# EAGLE design tssop38p (EAGLE 7.2.0)
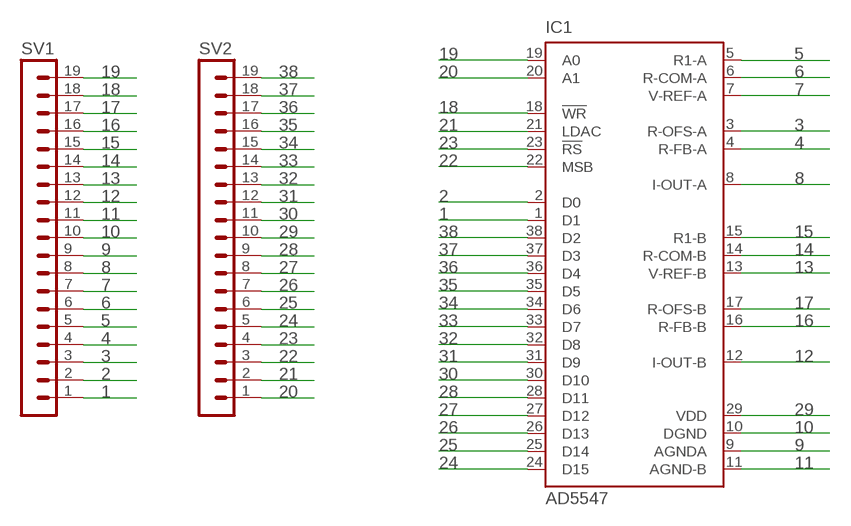
[diagram p0: schematic, sheet 1]

## Parts
IC1  AD5547  [TSSOP38]
SV1  MA19-1J  [MA19-1J]
SV2  MA19-1J  [MA19-1J]

## Nets
1: IC1.1(D1) SV1.1
2: IC1.2(D0) SV1.2
3: IC1.3(R-OFS-A) SV1.3
4: IC1.4(R-FB-A) SV1.4
5: IC1.5(R1-A) SV1.5
6: IC1.6(R-COM-A) SV1.6
7: IC1.7(V-REF-A) SV1.7
8: IC1.8(I-OUT-A) SV1.8
9: IC1.9(AGNDA) SV1.9
10: IC1.10(DGND) SV1.10
11: IC1.11(AGND-B) SV1.11
12: IC1.12(I-OUT-B) SV1.12
13: IC1.13(V-REF-B) SV1.13
14: IC1.14(R-COM-B) SV1.14
15: IC1.15(R1-B) SV1.15
16: IC1.16(R-FB-B) SV1.16
17: IC1.17(R-OFS-B) SV1.17
18: IC1.18(!WR) SV1.18
19: IC1.19(A0) SV1.19
20: IC1.20(A1) SV2.1
21: IC1.21(LDAC) SV2.2
22: IC1.22(MSB) SV2.3
23: IC1.23(!RS) SV2.4
24: IC1.24(D15) SV2.5
25: IC1.25(D14) SV2.6
26: IC1.26(D13) SV2.7
27: IC1.27(D12) SV2.8
28: IC1.28(D11) SV2.9
29: IC1.29(VDD) SV2.10
30: IC1.30(D10) SV2.11
31: IC1.31(D9) SV2.12
32: IC1.32(D8) SV2.13
33: IC1.33(D7) SV2.14
34: IC1.34(D6) SV2.15
35: IC1.35(D5) SV2.16
36: IC1.36(D4) SV2.17
37: IC1.37(D3) SV2.18
38: IC1.38(D2) SV2.19

## Library data of the parts
IC1 = joakim:AD5547: Dual-Current Output, Parallel Input 16 bit Multiplying DAC Source: http://www.analog.com/media/en/technical-documentation/data-sheets/AD5547_5557.pdf
SV1 SV2 = joakim:MA19-1J: PIN HEADER

## Board
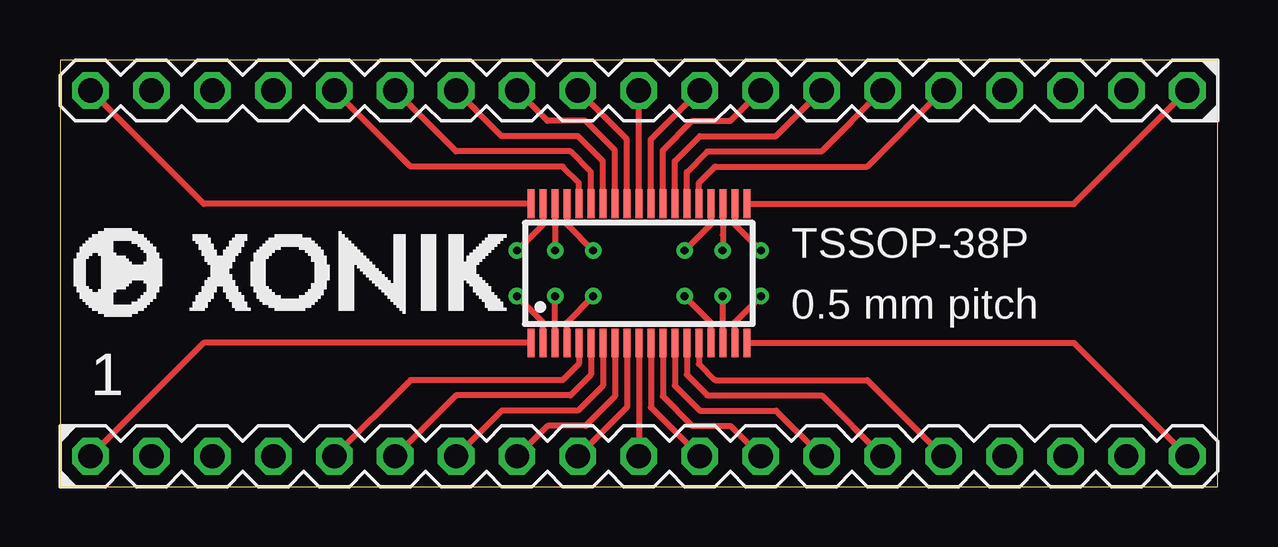
[diagram p1: board, top side]
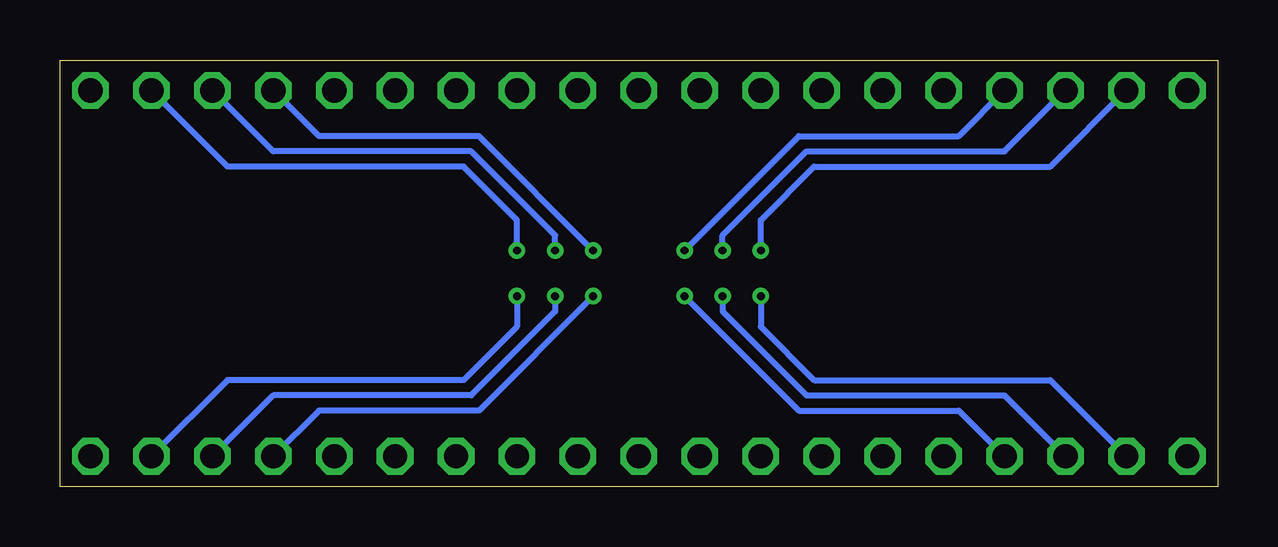
[diagram p2: board, bottom side, seen from below]

Size 48.26 x 17.78 mm. Coordinates in mm from the lower left corner, seen from the top.
Outline: 0,0 48.26,0 48.26,17.78 0,17.78 0,0
Copper layers (1*16): Top 0.0356mm / dielectric 1.5011mm / Bottom 0.0356mm
Design rules "LaenPCBOrder": minimum track width 6mil, minimum drill 13mil, track to track 6mil, track to pad 6mil, pad to pad 6mil, via to via 6mil, smd to smd 6mil, copper to edge 15mil, drill to drill 6mil, minimum pad ring 7mil, minimum via ring 7mil, stop-mask expansion 3mil, vias tented up to drill 0mil, thermal gap 10mil

### Footprints (pad centres in the part's own frame; a part is rotated, then mirrored left to right if it is on the bottom)
TSSOP38 = smd 0.3 x 1.2: 1 -4.5,-2.9; 2 -4,-2.9; 3 -3.5,-2.9; 4 -3,-2.9; 5 -2.5,-2.9; 6 -2,-2.9; 7 -1.5,-2.9; 8 -1,-2.9; 9 -0.5,-2.9; 10 0,-2.9; 11 0.5,-2.9; 12 1,-2.9; 13 1.5,-2.9; 14 2,-2.9; 15 2.5,-2.9; 16 3,-2.9; 17 3.5,-2.9; 18 4,-2.9; 19 4.5,-2.9; 20 4.5,2.9; 21 4,2.9; 22 3.5,2.9; 23 3,2.9; 24 2.5,2.9; 25 2,2.9; 26 1.5,2.9; 27 1,2.9; 28 0.5,2.9; 29 0,2.9; 30 -0.5,2.9; 31 -1,2.9; 32 -1.5,2.9; 33 -2,2.9; 34 -2.5,2.9; 35 -3,2.9; 36 -3.5,2.9; 37 -4,2.9; 38 -4.5,2.9
MA19-1J = drill 1.016 octagon: 1 -24.13,0; 2 -21.59,0; 3 -19.05,0; 4 -16.51,0; 5 -13.97,0; 6 -11.43,0; 7 -8.89,0; 8 -6.35,0; 9 -3.81,0; 10 -1.27,0; 11 1.27,0; 12 3.81,0; 13 6.35,0; 14 8.89,0; 15 11.43,0; 16 13.97,0; 17 16.51,0; 18 19.05,0; 19 21.59,0

### Placement (x,y rotation side)
IC1  24.13,8.89 0 top
SV1  25.4,1.27 0 top
SV2  22.86,16.51 180 top

### Tracks (layer width: path | path; a pad name or v marks a point on that pad's centre or on a via)
1
  Top 0.254: IC1.1 5.99,5.99 SV1.1
2  (via drill 0.33)
  Top 0.254: IC1.2 20.13,6.86 v19.05,7.94
  Bottom 0.254: v19.05,7.94 19.05,6.67 16.83,4.45 6.99,4.45 SV1.2
3  (via drill 0.33)
  Top 0.254: IC1.3 v20.63,7.93 v20.64,7.94
  Bottom 0.254: v20.64,7.94 20.64,7.3 17.14,3.81 8.89,3.81 SV1.3
4  (via drill 0.33)
  Top 0.254: IC1.4 21.13,6.84 v22.23,7.94
  Bottom 0.254: v22.23,7.94 17.46,3.17 10.79,3.17 SV1.4
5
  Top 0.254: IC1.5 21.63,5.12 20.95,4.45 14.61,4.45 SV1.5
6
  Top 0.254: IC1.6 22.13,4.67 21.27,3.81 16.51,3.81 SV1.6
7
  Top 0.254: IC1.7 22.63,4.21 21.59,3.17 18.41,3.17 SV1.7
8
  Top 0.254: IC1.8 23.13,3.76 21.91,2.54 20.32,2.54 SV1.8
9
  Top 0.254: IC1.9 23.63,3.31 SV1.9
10
  Top 0.254: IC1.10 SV1.10
11
  Top 0.254: IC1.11 24.63,3.31 SV1.11
12
  Top 0.254: IC1.12 25.13,3.76 26.35,2.54 27.94,2.54 SV1.12
13
  Top 0.254: IC1.13 25.63,4.21 26.67,3.17 29.84,3.17 SV1.13
14
  Top 0.254: IC1.14 26.13,4.67 26.99,3.81 31.75,3.81 SV1.14
15
  Top 0.254: IC1.15 26.63,5.12 27.3,4.45 33.66,4.45 SV1.15
16  (via drill 0.33)
  Top 0.254: IC1.16 27.13,6.84 v26.04,7.94
  Bottom 0.254: v26.04,7.94 30.8,3.17 37.47,3.17 SV1.16
17  (via drill 0.33)
  Top 0.254: IC1.17 v27.63,7.93 v27.62,7.94
  Bottom 0.254: v27.62,7.94 27.62,7.3 31.11,3.81 39.37,3.81 SV1.17
18  (via drill 0.33)
  Top 0.254: IC1.18 28.13,6.86 v29.21,7.94
  Bottom 0.254: v29.21,7.94 29.21,6.67 31.43,4.45 41.27,4.45 SV1.18
19
  Top 0.254: IC1.19 42.27,5.99 SV1.19
20
  Top 0.254: IC1.20 42.27,11.79 SV2.1
21  (via drill 0.33)
  Top 0.254: IC1.21 28.13,10.92 v29.21,9.84
  Bottom 0.254: v29.21,9.84 29.21,11.11 31.43,13.34 41.27,13.34 SV2.2
22  (via drill 0.33)
  Top 0.254: IC1.22 27.63,10.48 v27.62,9.84
  Bottom 0.254: v27.62,9.84 27.62,10.48 31.11,13.97 39.37,13.97 SV2.3
23  (via drill 0.33)
  Top 0.254: IC1.23 27.13,10.94 v26.04,9.84
  Bottom 0.254: v26.04,9.84 30.8,14.61 37.47,14.61 SV2.4
24
  Top 0.254: IC1.24 26.63,12.66 27.3,13.34 33.66,13.34 SV2.5
25
  Top 0.254: IC1.25 26.13,13.11 26.99,13.97 31.75,13.97 SV2.6
26
  Top 0.254: IC1.26 25.63,13.56 26.67,14.61 29.84,14.61 SV2.7
27
  Top 0.254: IC1.27 25.13,14.02 26.35,15.24 27.94,15.24 SV2.8
28
  Top 0.254: IC1.28 24.63,14.47 SV2.9
29
  Top 0.254: IC1.29 SV2.10
30
  Top 0.254: IC1.30 23.63,14.47 SV2.11
31
  Top 0.254: IC1.31 23.13,14.02 21.91,15.24 20.32,15.24 SV2.12
32
  Top 0.254: IC1.32 22.63,13.56 21.59,14.61 18.41,14.61 SV2.13
33
  Top 0.254: IC1.33 22.13,13.11 21.27,13.97 16.51,13.97 SV2.14
34
  Top 0.254: IC1.34 21.63,12.66 20.95,13.34 14.61,13.34 SV2.15
35  (via drill 0.33)
  Top 0.254: IC1.35 21.13,10.94 v22.23,9.84
  Bottom 0.254: v22.23,9.84 17.46,14.61 10.79,14.61 SV2.16
36  (via drill 0.33)
  Top 0.254: IC1.36 v20.63,9.85 v20.64,9.84
  Bottom 0.254: v20.64,9.84 20.64,10.48 17.14,13.97 8.89,13.97 SV2.17
37  (via drill 0.33)
  Top 0.254: IC1.37 20.13,10.92 v19.05,9.84
  Bottom 0.254: v19.05,9.84 19.05,11.11 16.83,13.34 6.99,13.34 SV2.18
38
  Top 0.254: IC1.38 5.99,11.79 SV2.19

### Text on the board
tPlace: TSSOP-38P | 0.5 mm pitch | 1